# Altium schematic sheet PCB.SchDoc
size A
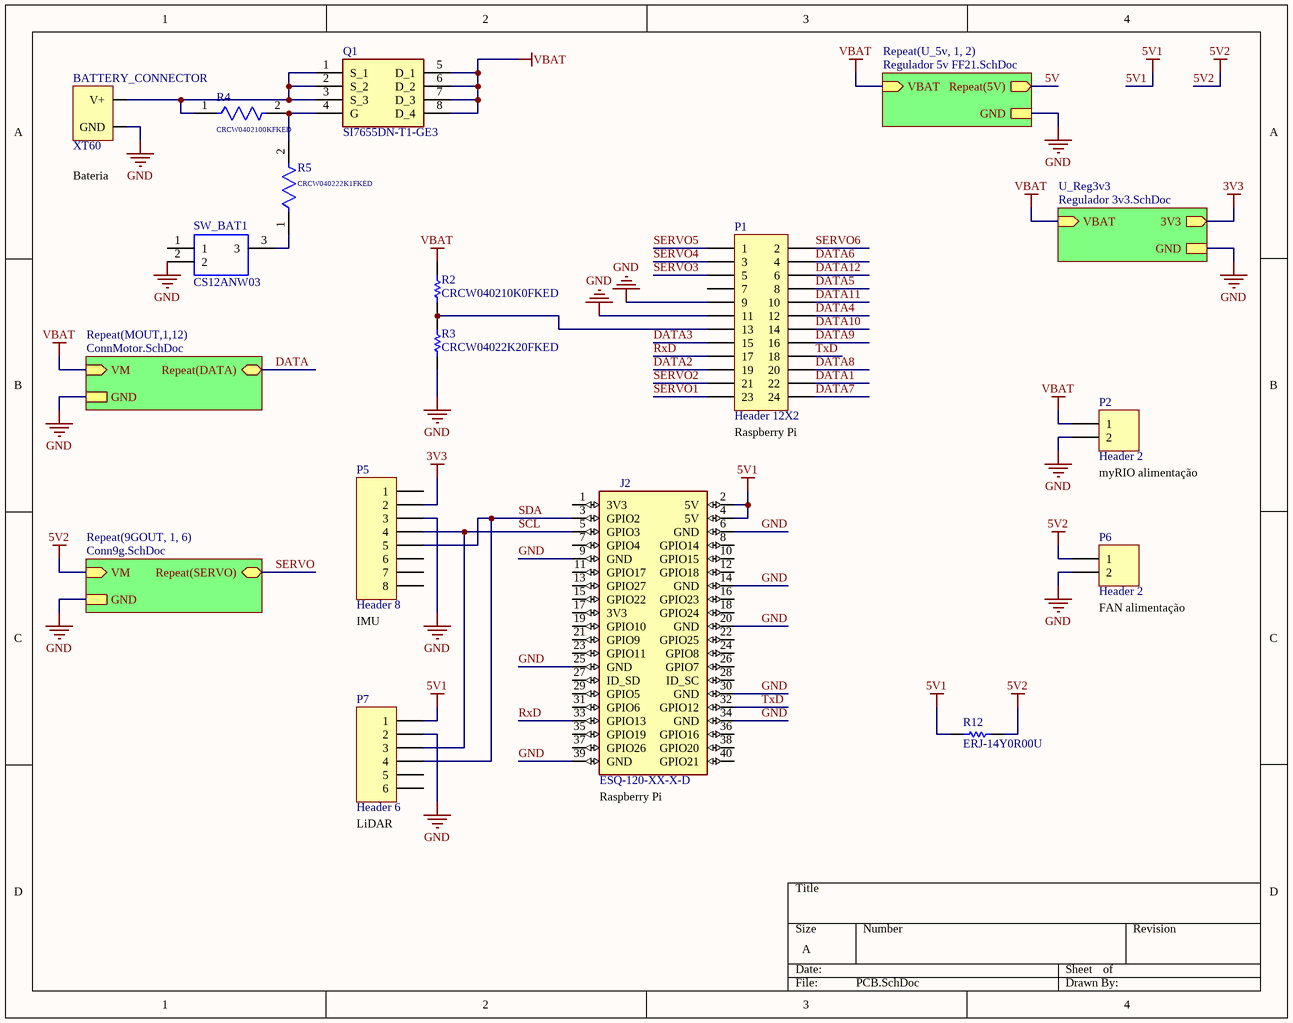
[diagram p0: PCB.SchDoc]

## Parts
BATTERY_CONNECTOR  XT60  [BATTERY_CONECTO-PCB]
J2  ESQ-120-XX-X-D  [ESQ-120-XX-X-D]
P1  Header 12X2  [HDR2X12]
P2  Header 2  [HDR1X2]
P5  Header 8  [HDR1X8]
P6  Header 2  [HDR1X2]
P7  Header 6  [HDR1X6]
Q1  SI7655DN-T1-GE3  [SIS862DNT1GE3]
R2  CRCW040210K0FKED  [RESC1005X40X25NL05T05]
R3  CRCW04022K20FKED  [RESC1005X40X25NL05T05]
R4  CRCW0402100KFKED  [FP-CRCW0402-e3-IPC_A]
R5  CRCW040222K1FKED  [FP-CRCW0402-e3-IPC_A]
R12  ERJ-14Y0R00U  [RESC3225X70X50NL20T20]
SW_BAT1  CS12ANW03  [CS12ANW03]

## Sub-sheets
Repeat(9GOUT, 1, 6) = Conn9g.SchDoc: VM (in), GND, Repeat(SERVO) (bidir)
Repeat(MOUT,1,12) = ConnMotor.SchDoc: GND, VM (in), Repeat(DATA) (bidir)
Repeat(U_5v, 1, 2) = Regulador 5v FF21.SchDoc: Repeat(5V) (out), GND, VBAT (in)
U_Reg3v3 = Regulador 3v3.SchDoc: VBAT (in), 3V3 (out), GND

## Nets
3V3: P5.2 ; sheet U_Reg3v3/3V3
5V1: J2.2(5V) J2.4(5V) P7.1 R12.1
5V2: P6.1 R12.2 ; sheet Repeat(9GOUT, 1, 6)/VM
GND: BATTERY_CONNECTOR.1(GND) J2.6(GND) J2.9(GND) J2.14(GND) J2.20(GND) J2.25(GND) J2.30(GND) J2.34(GND) J2.39(GND) P1.9 P1.11 P2.2 P5.3 P6.2 P7.2 R3.1 SW_BAT1.2 ; sheet Repeat(U_5v, 1, 2)/GND, sheet U_Reg3v3/GND, sheet Repeat(MOUT,1,12)/GND, sheet Repeat(9GOUT, 1, 6)/GND
VBAT: P2.1 Q1.5(D_1) Q1.6(D_2) Q1.7(D_3) Q1.8(D_4) R2.2 ; sheet Repeat(U_5v, 1, 2)/VBAT, sheet U_Reg3v3/VBAT, sheet Repeat(MOUT,1,12)/VM
5V: sheet Repeat(U_5v, 1, 2)/Repeat(5V)
DATA: sheet Repeat(MOUT,1,12)/Repeat(DATA)
DATA1: P1.22
DATA2: P1.19
DATA3: P1.15
DATA4: P1.12
DATA5: P1.8
DATA6: P1.4
DATA7: P1.24
DATA8: P1.20
DATA9: P1.16
DATA10: P1.14
DATA11: P1.10
DATA12: P1.6
RxD: J2.33(GPIO13) P1.17
SCL: J2.5(GPIO3) P5.4 P7.3
SDA: J2.3(GPIO2) P5.5 P7.4
SERVO: sheet Repeat(9GOUT, 1, 6)/Repeat(SERVO)
SERVO1: P1.23
SERVO2: P1.21
SERVO3: P1.5
SERVO4: P1.3
SERVO5: P1.1
SERVO6: P1.2
TxD: J2.32(GPIO12) P1.18
NetBATTERY_CONNECTOR_0: BATTERY_CONNECTOR.0(V+) Q1.1(S_1) Q1.2(S_2) Q1.3(S_3) R4.1
NetP1_13: P1.13 R2.1 R3.2
NetQ1_4: Q1.4(G) R4.2 R5.2
NetR5_1: R5.1 SW_BAT1.3

Not connected (* = marked no-connect by the designer): J2 1(3V3) 7(GPIO4) 8(GPIO14) 10(GPIO15) 11(GPIO17) 12(GPIO18) 13(GPIO27) 15(GPIO22) 16(GPIO23) 17(3V3) 18(GPIO24) 19(GPIO10) 21(GPIO9) 22(GPIO25) 23(GPIO11) 24(GPIO8) 26(GPIO7) 27(ID_SD) 28(ID_SC) 29(GPIO5) 31(GPIO6) 35(GPIO19) 36(GPIO16) 37(GPIO26) 38(GPIO20) 40(GPIO21); P1 7; P5 1 6 7 8; P7 5 6; SW_BAT1 1

## Notes on the sheet
- (near BATTERY_CONNECTOR) Bateria
- (near P1) Raspberry Pi 4 Model B
- (near P2) myRIO alimentação
- (near P5) IMU
- (near P6) FAN alimentação
- (near P7) LiDAR
- (near J2) Raspberry Pi

## Library data of the parts
BATTERY_CONNECTOR = BATTERY_CONNECTOR: XT60 PRT-10474
J2 = ESQ-120-XX-X-D: ESQ Series .100 PC/104â„¢ Elevated Socket Strip; MP: ESQ-120-38-S-D; MF: Samtec; Digi-Key_Purchase_URL: https://www.digikey.com/product-detail/en/samtec-inc/ESQ-120-38-S-D/ESQ-120-38-S-D-ND/7098755?utm_source=snapeda&utm_medium=aggregator&utm_campaign=symbol; SnapEDA_Link: https://www.snapeda.com/parts/ESQ-120-38-S-D/Samtec%20Inc/view-part/786160/?ref=snap; Digi-Key_Part_Number: ESQ-120-38-S-D-ND; Value: *; Package: None
P1 = Header 12X2: Header, 12-Pin, Dual row; LatestRevisionDate: 17-Jul-2002; LatestRevisionNote: Re-released for DXP Platform.; Publisher: Altium Limited
P2 P6 = Header 2: Header, 2-Pin; LatestRevisionDate: 17-Jul-2002; LatestRevisionNote: Re-released for DXP Platform.; Publisher: Altium Limited
P5 = Header 8: Header, 8-Pin; LatestRevisionDate: 17-Jul-2002; LatestRevisionNote: Re-released for DXP Platform.; Publisher: Altium Limited
P7 = Header 6: Header, 6-Pin; LatestRevisionDate: 17-Jul-2002; LatestRevisionNote: Re-released for DXP Platform.; Publisher: Altium Limited
Q1 = SI7655DN-T1-GE3: MOSFET (P-Channel); Manufacturer_Name: Vishay; Datasheet Link: https://www.vishay.com/docs/63617/si7655dn.pdf; Manufacturer_Part_Number: SI7655DN-T1-GE3; Arrow Part Number: SI7655DN-T1-GE3; Arrow Price/Stock: https://www.arrow.com/en/products/si7655dn-t1-ge3/vishay; Mouser Part Number: 78-SI7655DN-T1-GE3; Mouser Price/Stock: https://www.mouser.com/Search/Refine.aspx?Keyword=78-SI7655DN-T1-GE3
R2 = CMP-2002-08135-1: Manufacturer: Vishay Dale; Part Number: CRCW040210K0FKED
R3 = CMP-2002-08452-1: Manufacturer: Vishay Dale; Part Number: CRCW04022K20FKED
R4 = CMP-2002-08123-3: RES Thick Film, 100kΩ, 1%, 0.063W, 100ppm/°C, 0402; Power Rating: 63mW; Resistance: 100kR; Voltage Rating (DC): 50V; Lead Free: Lead Free; Height: 0.35mm; Contact Plating: Tin; Min Operating Temperature: -55°C; Package Quantity: 10000; Case/Package: 0402; Temperature Coefficient: 100ppm/°C; Number of Terminations: 2; Packaging: Tape and Reel; Max Power Dissipation: 63mW; Case Code (Metric): 1005; Mount: Surface Mount; Width: 0.02inch; Termination: SMD/SMT; Length: 1mm; Number of Pins: 2; Weight: 2.3E-05oz; Radiation Hardening: No; Tolerance: 1%; Military Standard: Not; Features: Automotive AEC-Q200; Depth: 0.5mm; Composition: Thick Film; Max Operating Temperature: 155°C; Voltage Rating: 50V; Case Code (Imperial): 0402
R5 = CMP-2002-08380-2: RES Thick Film, 22.1kΩ, 1%, 0.063W, 100ppm/°C, 0402; Voltage Rating: 50V; Resistance: 22.1kR; Power Rating: 63mW; Length: 1mm; Termination: SMD/SMT; Height: 0.35mm; Package Quantity: 10000; Depth: 0.5mm; Lead Free: Lead Free; Packaging: Tape and Reel; Case/Package: 0402; Max Operating Temperature: 155°C; Composition: Thick Film; Min Operating Temperature: -55°C; Working Voltage: 50V; Number of Pins: 2; Contact Plating: Tin; Mount: Surface Mount; Case Code (Imperial): 0402; Temperature Coefficient: 100ppm/°C; Tolerance: 1%; Voltage Rating (DC): 50V; Width: 0.5mm; Number of Terminations: 2; Radiation Hardening: No; Weight: 2.3E-05oz; Military Standard: Not; Case Code (Metric): 1005
R12 = CMP-2005-03837-1: Manufacturer: Panasonic; Part Number: ERJ-14Y0R00U
SW_BAT1 = CS12ANW03: NKK SWITCHES - CS12ANW03 - SWITCH, SLIDE, SPDT, 3A, 250V, TH; Allied_Number: 70228233; Manufacturer_Name: NKK Switches; Manufacturer_Part_Number: CS12ANW03; RS Part Number: 1251847; RS Price/Stock: http://uk.rs-online.com/web/p/products/1251847; Allied Price/Stock: https://www.alliedelec.com/nkk-switches-cs12anw03/70228233/; Arrow Part Number: CS12ANW03; Arrow Price/Stock: https://www.arrow.com/en/products/cs12anw03/nkk-switches; Datasheet Link: http://www.nkkswitches.com/pdf/cs.pdf